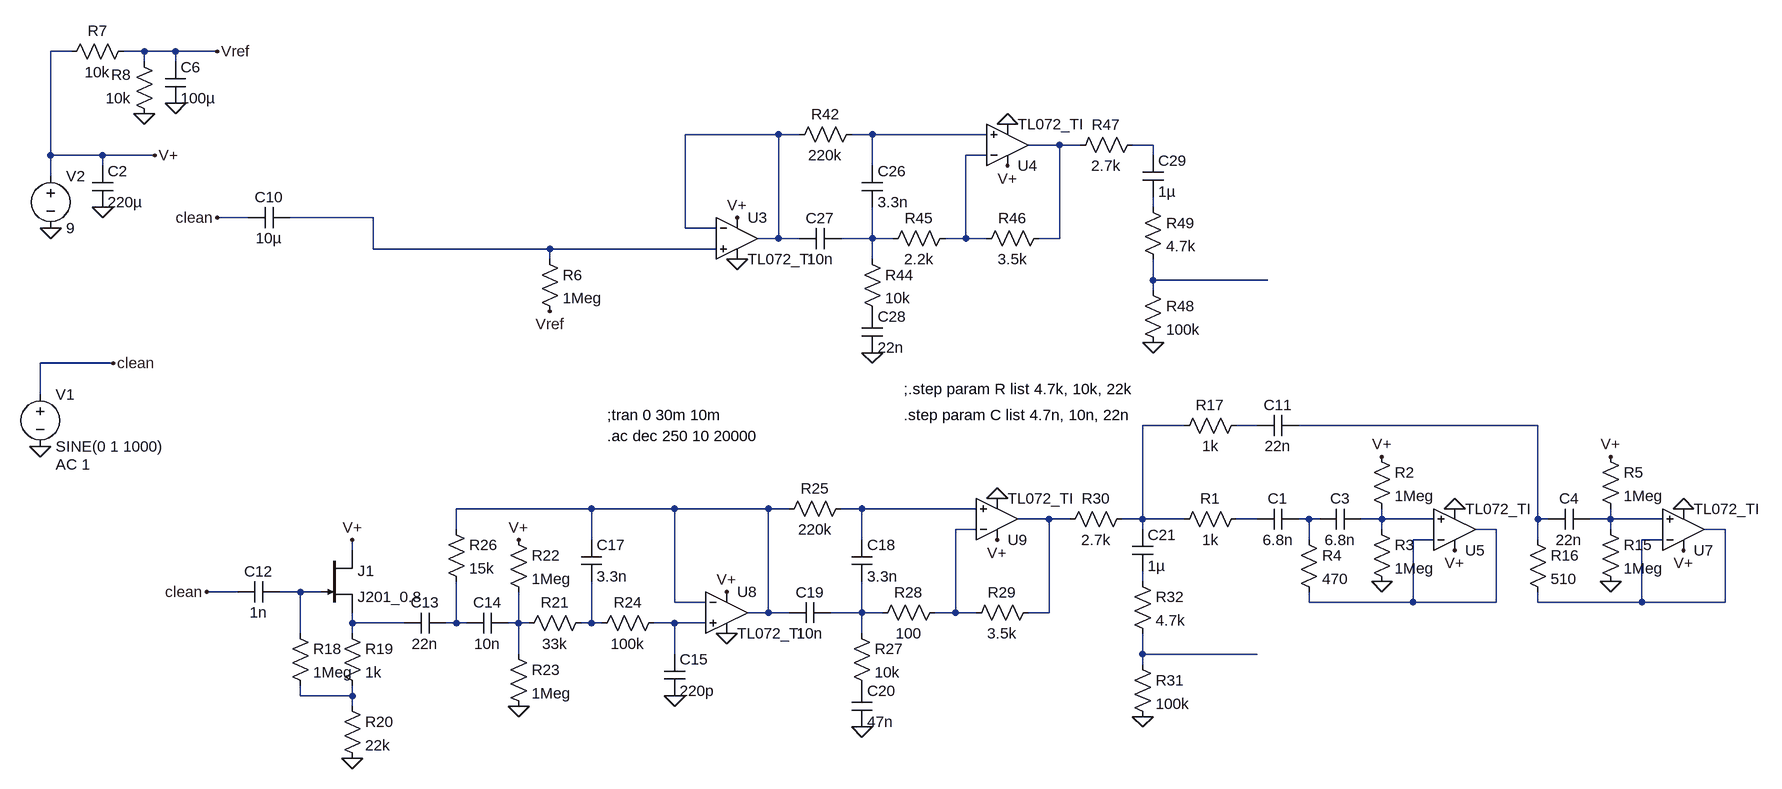
[diagram p0: schematic speakersim.asc]
speakersim.asc, the LTspice schematic file:
Version 4
SHEET 1 3028 1204
WIRE 0 80 -32 80
WIRE 112 80 80 80
WIRE 160 80 112 80
WIRE 224 80 160 80
WIRE 112 96 112 80
WIRE 160 96 160 80
WIRE 1088 208 944 208
WIRE 1120 208 1088 208
WIRE 1232 208 1200 208
WIRE 1408 208 1232 208
WIRE 1520 224 1472 224
WIRE 1552 224 1520 224
WIRE 1664 224 1632 224
WIRE -32 240 -32 80
WIRE 48 240 -32 240
WIRE 128 240 48 240
WIRE 1408 240 1376 240
WIRE 1664 240 1664 224
WIRE 48 256 48 240
WIRE 1232 256 1232 208
WIRE -32 272 -32 240
WIRE 1664 320 1664 304
WIRE 272 336 224 336
WIRE 464 336 336 336
WIRE 944 352 944 208
WIRE 992 352 944 352
WIRE 1088 368 1088 208
WIRE 1088 368 1056 368
WIRE 1120 368 1088 368
WIRE 1232 368 1232 320
WIRE 1232 368 1184 368
WIRE 1264 368 1232 368
WIRE 1376 368 1376 240
WIRE 1376 368 1344 368
WIRE 1408 368 1376 368
WIRE 1520 368 1520 224
WIRE 1520 368 1488 368
WIRE 464 384 464 336
WIRE 736 384 464 384
WIRE 992 384 736 384
WIRE 736 400 736 384
WIRE 1232 400 1232 368
WIRE 1664 432 1664 400
WIRE 1840 432 1664 432
WIRE 1664 448 1664 432
WIRE 64 560 -48 560
WIRE -48 608 -48 560
WIRE 1712 656 1648 656
WIRE 1824 656 1792 656
WIRE 2256 656 1888 656
WIRE 800 784 592 784
WIRE 928 784 800 784
WIRE 1072 784 928 784
WIRE 1104 784 1072 784
WIRE 1216 784 1184 784
WIRE 1392 784 1216 784
WIRE 1504 800 1456 800
WIRE 1536 800 1504 800
WIRE 1648 800 1648 656
WIRE 1648 800 1616 800
WIRE 1712 800 1648 800
WIRE 1824 800 1792 800
WIRE 1904 800 1888 800
WIRE 1920 800 1904 800
WIRE 2016 800 2016 784
WIRE 2016 800 1984 800
WIRE 2096 800 2016 800
WIRE 2256 800 2256 656
WIRE 2272 800 2256 800
WIRE 2368 800 2368 784
WIRE 2368 800 2336 800
WIRE 2448 800 2368 800
WIRE 592 816 592 784
WIRE 1392 816 1360 816
WIRE 1648 816 1648 800
WIRE 2016 816 2016 800
WIRE 2192 816 2160 816
WIRE 2368 816 2368 800
WIRE 2544 816 2512 816
WIRE 800 832 800 784
WIRE 1216 832 1216 784
WIRE 1904 832 1904 800
WIRE 2096 832 2064 832
WIRE 2256 832 2256 800
WIRE 2448 832 2416 832
WIRE 432 848 432 832
WIRE 1648 896 1648 880
WIRE 256 912 208 912
WIRE 352 912 320 912
WIRE 384 912 352 912
WIRE 928 928 928 784
WIRE 976 928 928 928
WIRE 1904 928 1904 912
WIRE 2064 928 2064 832
WIRE 2064 928 1904 928
WIRE 2192 928 2192 816
WIRE 2192 928 2064 928
WIRE 2256 928 2256 912
WIRE 2416 928 2416 832
WIRE 2416 928 2256 928
WIRE 2544 928 2544 816
WIRE 2544 928 2416 928
WIRE 1072 944 1072 784
WIRE 1072 944 1040 944
WIRE 1104 944 1072 944
WIRE 1216 944 1216 896
WIRE 1216 944 1168 944
WIRE 1248 944 1216 944
WIRE 1360 944 1360 816
WIRE 1360 944 1328 944
WIRE 1392 944 1360 944
WIRE 1504 944 1504 800
WIRE 1504 944 1472 944
WIRE 432 960 432 944
WIRE 512 960 432 960
WIRE 592 960 592 896
WIRE 592 960 576 960
WIRE 608 960 592 960
WIRE 688 960 688 912
WIRE 688 960 672 960
WIRE 704 960 688 960
WIRE 800 960 800 896
WIRE 800 960 784 960
WIRE 816 960 800 960
WIRE 928 960 896 960
WIRE 976 960 928 960
WIRE 352 976 352 912
WIRE 432 976 432 960
WIRE 1216 976 1216 944
WIRE 688 1008 688 960
WIRE 928 1008 928 960
WIRE 1648 1008 1648 976
WIRE 1824 1008 1648 1008
WIRE 1648 1024 1648 1008
WIRE 352 1072 352 1056
WIRE 432 1072 432 1056
WIRE 432 1072 352 1072
WIRE 432 1088 432 1072
FLAG -48 688 0
FLAG -32 352 0
FLAG 128 240 V+
FLAG 48 320 0
FLAG 112 176 0
FLAG 160 160 0
FLAG 224 80 Vref
FLAG 2128 848 V+
FLAG 2128 784 0
FLAG 2016 896 0
FLAG 2016 704 V+
FLAG 2480 848 V+
FLAG 2480 784 0
FLAG 2368 896 0
FLAG 2368 704 V+
FLAG 432 832 V+
FLAG 432 1168 0
FLAG 1008 912 V+
FLAG 1008 976 0
FLAG 688 1088 0
FLAG 928 1072 0
FLAG 688 832 V+
FLAG 1424 832 V+
FLAG 1424 768 0
FLAG 1216 1120 0
FLAG 1648 1104 0
FLAG 1024 336 V+
FLAG 1024 400 0
FLAG 1440 256 V+
FLAG 1440 192 0
FLAG 1232 544 0
FLAG 1664 528 0
FLAG 224 336 clean
FLAG 208 912 clean
FLAG 64 560 clean
FLAG 736 480 Vref
SYMBOL voltage -48 592 R0
WINDOW 123 24 124 Left 2
WINDOW 39 0 0 Left 2
SYMATTR Value2 AC 1
SYMATTR InstName V1
SYMATTR Value SINE(0 1 1000)
SYMBOL voltage -32 256 R0
WINDOW 123 0 0 Left 2
WINDOW 39 0 0 Left 2
SYMATTR InstName V2
SYMATTR Value 9
SYMBOL cap 32 256 R0
SYMATTR InstName C2
SYMATTR Value 220µ
SYMBOL res 96 64 R90
WINDOW 0 0 56 VBottom 2
WINDOW 3 32 56 VTop 2
SYMATTR InstName R7
SYMATTR Value 10k
SYMBOL res 128 192 R180
WINDOW 0 36 76 Left 2
WINDOW 3 36 40 Left 2
SYMATTR InstName R8
SYMATTR Value 10k
SYMBOL cap 144 96 R0
SYMATTR InstName C6
SYMATTR Value 100µ
SYMBOL res 1808 784 R90
WINDOW 0 0 56 VBottom 2
WINDOW 3 32 56 VTop 2
SYMATTR InstName R1
SYMATTR Value 1k
SYMBOL cap 1888 784 R90
WINDOW 0 0 32 VBottom 2
WINDOW 3 32 32 VTop 2
SYMATTR InstName C1
SYMATTR Value 6.8n
SYMBOL res 2000 688 R0
SYMATTR InstName R2
SYMATTR Value 1Meg
SYMBOL res 2000 800 R0
SYMATTR InstName R3
SYMATTR Value 1Meg
SYMBOL cap 1984 784 R90
WINDOW 0 0 32 VBottom 2
WINDOW 3 32 32 VTop 2
SYMATTR InstName C3
SYMATTR Value 6.8n
SYMBOL EXTRA\\AudioOpamp\\TI\\TL072_TI 2128 816 M180
SYMATTR InstName U5
SYMBOL res 1888 816 R0
SYMATTR InstName R4
SYMATTR Value 470
SYMBOL res 2352 688 R0
SYMATTR InstName R5
SYMATTR Value 1Meg
SYMBOL res 2352 800 R0
SYMATTR InstName R15
SYMATTR Value 1Meg
SYMBOL cap 2336 784 R90
WINDOW 0 0 32 VBottom 2
WINDOW 3 32 32 VTop 2
SYMATTR InstName C4
SYMATTR Value 22n
SYMBOL EXTRA\\AudioOpamp\\TI\\TL072_TI 2480 816 M180
SYMATTR InstName U7
SYMBOL res 2240 816 R0
SYMATTR InstName R16
SYMATTR Value 510
SYMBOL res 1808 640 R90
WINDOW 0 0 56 VBottom 2
WINDOW 3 32 56 VTop 2
SYMATTR InstName R17
SYMATTR Value 1k
SYMBOL cap 1888 640 R90
WINDOW 0 0 32 VBottom 2
WINDOW 3 32 32 VTop 2
SYMATTR InstName C11
SYMATTR Value 22n
SYMBOL njf 384 848 R0
SYMATTR InstName J1
SYMATTR Value J201_0.8
SYMBOL cap 320 896 R90
WINDOW 0 0 32 VBottom 2
WINDOW 3 32 32 VTop 2
SYMATTR InstName C12
SYMATTR Value 1n
SYMBOL res 336 960 R0
SYMATTR InstName R18
SYMATTR Value 1Meg
SYMBOL res 416 960 R0
SYMATTR InstName R19
SYMATTR Value 1k
SYMBOL res 416 1072 R0
SYMATTR InstName R20
SYMATTR Value 22k
SYMBOL cap 576 944 R90
WINDOW 0 0 32 VBottom 2
WINDOW 3 32 32 VTop 2
SYMATTR InstName C13
SYMATTR Value 22n
SYMBOL EXTRA\\AudioOpamp\\TI\\TL072_TI 1008 944 R0
SYMATTR InstName U8
SYMBOL cap 672 944 R90
WINDOW 0 0 32 VBottom 2
WINDOW 3 32 32 VTop 2
SYMATTR InstName C14
SYMATTR Value 10n
SYMBOL res 800 944 R90
WINDOW 0 0 56 VBottom 2
WINDOW 3 32 56 VTop 2
SYMATTR InstName R21
SYMATTR Value 33k
SYMBOL res 672 816 R0
SYMATTR InstName R22
SYMATTR Value 1Meg
SYMBOL res 672 992 R0
SYMATTR InstName R23
SYMATTR Value 1Meg
SYMBOL res 912 944 R90
WINDOW 0 0 56 VBottom 2
WINDOW 3 32 56 VTop 2
SYMATTR InstName R24
SYMATTR Value 100k
SYMBOL cap 912 1008 R0
SYMATTR InstName C15
SYMATTR Value 220p
SYMBOL res 1200 768 R90
WINDOW 0 0 56 VBottom 2
WINDOW 3 32 56 VTop 2
SYMATTR InstName R25
SYMATTR Value 220k
SYMBOL cap 784 832 R0
SYMATTR InstName C17
SYMATTR Value 3.3n
SYMBOL res 576 800 R0
SYMATTR InstName R26
SYMATTR Value 15k
SYMBOL EXTRA\\AudioOpamp\\TI\\TL072_TI 1424 800 M180
SYMATTR InstName U9
SYMBOL cap 1200 832 R0
SYMATTR InstName C18
SYMATTR Value 3.3n
SYMBOL cap 1168 928 R90
WINDOW 0 0 32 VBottom 2
WINDOW 3 32 32 VTop 2
SYMATTR InstName C19
SYMATTR Value 10n
SYMBOL res 1200 960 R0
SYMATTR InstName R27
SYMATTR Value 10k
SYMBOL cap 1200 1056 R0
SYMATTR InstName C20
SYMATTR Value 47n
SYMBOL res 1344 928 R90
WINDOW 0 0 56 VBottom 2
WINDOW 3 32 56 VTop 2
SYMATTR InstName R28
SYMATTR Value 100
SYMBOL res 1488 928 R90
WINDOW 0 0 56 VBottom 2
WINDOW 3 32 56 VTop 2
SYMATTR InstName R29
SYMATTR Value 3.5k
SYMBOL res 1632 784 R90
WINDOW 0 0 56 VBottom 2
WINDOW 3 32 56 VTop 2
SYMATTR InstName R30
SYMATTR Value 2.7k
SYMBOL cap 1632 816 R0
SYMATTR InstName C21
SYMATTR Value 1µ
SYMBOL res 1632 1008 R0
SYMATTR InstName R31
SYMATTR Value 100k
SYMBOL res 1632 880 R0
SYMATTR InstName R32
SYMATTR Value 4.7k
SYMBOL cap 336 320 R90
WINDOW 0 0 32 VBottom 2
WINDOW 3 32 32 VTop 2
SYMATTR InstName C10
SYMATTR Value 10µ
SYMBOL EXTRA\\AudioOpamp\\TI\\TL072_TI 1024 368 R0
SYMATTR InstName U3
SYMBOL res 1216 192 R90
WINDOW 0 0 56 VBottom 2
WINDOW 3 32 56 VTop 2
SYMATTR InstName R42
SYMATTR Value 220k
SYMBOL EXTRA\\AudioOpamp\\TI\\TL072_TI 1440 224 M180
SYMATTR InstName U4
SYMBOL cap 1216 256 R0
SYMATTR InstName C26
SYMATTR Value 3.3n
SYMBOL cap 1184 352 R90
WINDOW 0 0 32 VBottom 2
WINDOW 3 32 32 VTop 2
SYMATTR InstName C27
SYMATTR Value 10n
SYMBOL res 1216 384 R0
SYMATTR InstName R44
SYMATTR Value 10k
SYMBOL cap 1216 480 R0
SYMATTR InstName C28
SYMATTR Value 22n
SYMBOL res 1360 352 R90
WINDOW 0 0 56 VBottom 2
WINDOW 3 32 56 VTop 2
SYMATTR InstName R45
SYMATTR Value 2.2k
SYMBOL res 1504 352 R90
WINDOW 0 0 56 VBottom 2
WINDOW 3 32 56 VTop 2
SYMATTR InstName R46
SYMATTR Value 3.5k
SYMBOL res 1648 208 R90
WINDOW 0 0 56 VBottom 2
WINDOW 3 32 56 VTop 2
SYMATTR InstName R47
SYMATTR Value 2.7k
SYMBOL cap 1648 240 R0
SYMATTR InstName C29
SYMATTR Value 1µ
SYMBOL res 1648 432 R0
SYMATTR InstName R48
SYMATTR Value 100k
SYMBOL res 1648 304 R0
SYMATTR InstName R49
SYMATTR Value 4.7k
SYMBOL res 720 384 R0
SYMATTR InstName R6
SYMATTR Value 1Meg
TEXT 824 640 Left 2 !;tran 0 30m 10m
TEXT 824 672 Left 2 !.ac dec 250 10 20000
TEXT 1280 600 Left 2 !;.step param R list 4.7k, 10k, 22k
TEXT 1280 640 Left 2 !.step param C list 4.7n, 10n, 22n

The netlist it stands for:
* speakersim.asc
V1 clean 0 SINE(0 1 1000) AC 1
V2 V+ 0 9
C2 V+ 0 220µ
R7 Vref V+ 10k
R8 0 Vref 10k
C6 Vref 0 100µ
R1 N016 N010 1k
C1 N017 N016 6.8n
R2 V+ N018 1Meg
R3 N018 0 1Meg
C3 N018 N017 6.8n
* U5: TL072_TI (symbol EXTRA\AudioOpamp\TI\TL072_TI not available, pins judged from their places): In+=N018 In-=N021 V+=V+ V-=0 OUT=N021
R4 N017 N021 470
R5 V+ N019 1Meg
R15 N019 0 1Meg
C4 N019 N012 22n
* U7: TL072_TI (symbol EXTRA\AudioOpamp\TI\TL072_TI not available, pins judged from their places): In+=N019 In-=N022 V+=V+ V-=0 OUT=N022
R16 N012 N022 510
R17 N011 N010 1k
C11 N012 N011 22n
J1 V+ N024 N026 J201_0.8
C12 N024 clean 1n
R18 N024 N032 1Meg
R19 N026 N032 1k
R20 N032 0 22k
C13 N027 N026 22n
* U8: TL072_TI (symbol EXTRA\AudioOpamp\TI\TL072_TI not available, pins judged from their places): In+=N030 In-=N013 V+=V+ V-=0 OUT=N013
C14 N028 N027 10n
R21 N029 N028 33k
R22 V+ N028 1Meg
R23 N028 0 1Meg
R24 N030 N029 100k
C15 N030 0 220p
R25 N014 N013 220k
C17 N013 N029 3.3n
R26 N013 N027 15k
* U9: TL072_TI (symbol EXTRA\AudioOpamp\TI\TL072_TI not available, pins judged from their places): In+=N014 In-=N020 V+=V+ V-=0 OUT=N015
C18 N014 N025 3.3n
C19 N025 N013 10n
R27 N025 P001 10k
C20 P001 0 47n
R28 N020 N025 100
R29 N015 N020 3.5k
R30 N010 N015 2.7k
C21 N010 N023 1µ
R31 N031 0 100k
R32 N023 N031 4.7k
C10 N007 clean 10µ
* U3: TL072_TI (symbol EXTRA\AudioOpamp\TI\TL072_TI not available, pins judged from their places): In+=N007 In-=N001 V+=V+ V-=0 OUT=N001
R42 N002 N001 220k
* U4: TL072_TI (symbol EXTRA\AudioOpamp\TI\TL072_TI not available, pins judged from their places): In+=N002 In-=N005 V+=V+ V-=0 OUT=N003
C26 N002 N008 3.3n
C27 N008 N001 10n
R44 N008 P002 10k
C28 P002 0 22n
R45 N005 N008 2.2k
R46 N003 N005 3.5k
R47 N004 N003 2.7k
C29 N004 N006 1µ
R48 N009 0 100k
R49 N006 N009 4.7k
R6 N007 Vref 1Meg
.model NJF NJF
.model PJF PJF
.lib standard.jft
;tran 0 30m 10m
.ac dec 250 10 20000
;.step param R list 4.7k, 10k, 22k
.step param C list 4.7n, 10n, 22n
.backanno
.end